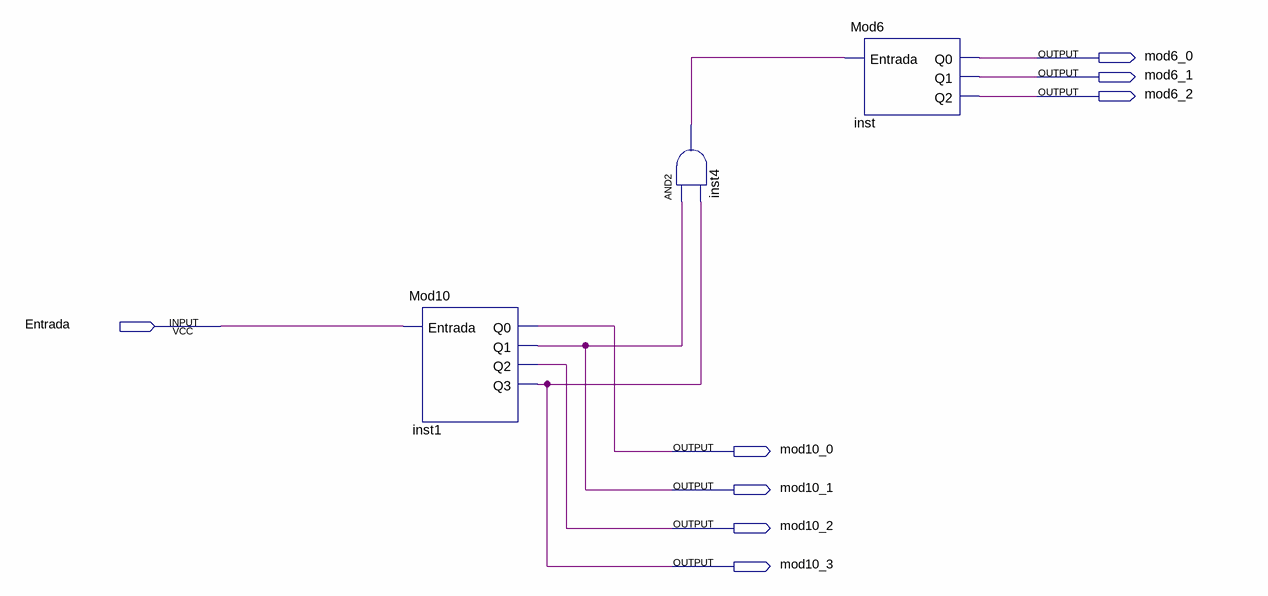
[diagram p0: schematic sheet]
// Quartus schematic Mod60.bdf as structural Verilog: 3 symbols, 8 pins
module Mod60 (
  input  Entrada,
  output mod6_0,
  output mod6_1,
  output mod6_2,
  output mod10_0,
  output mod10_1,
  output mod10_2,
  output mod10_3
);

  wire inst4_out;

  Mod10 inst1 (.Entrada(Entrada), .Q0(mod10_0), .Q1(mod10_1), .Q2(mod10_2), .Q3(mod10_3));
  and inst4 (inst4_out, mod10_1, mod10_3);
  Mod6 inst (.Entrada(inst4_out), .Q0(mod6_0), .Q1(mod6_1), .Q2(mod6_2));
endmodule
